# Altium project AM3359.PRJPCB
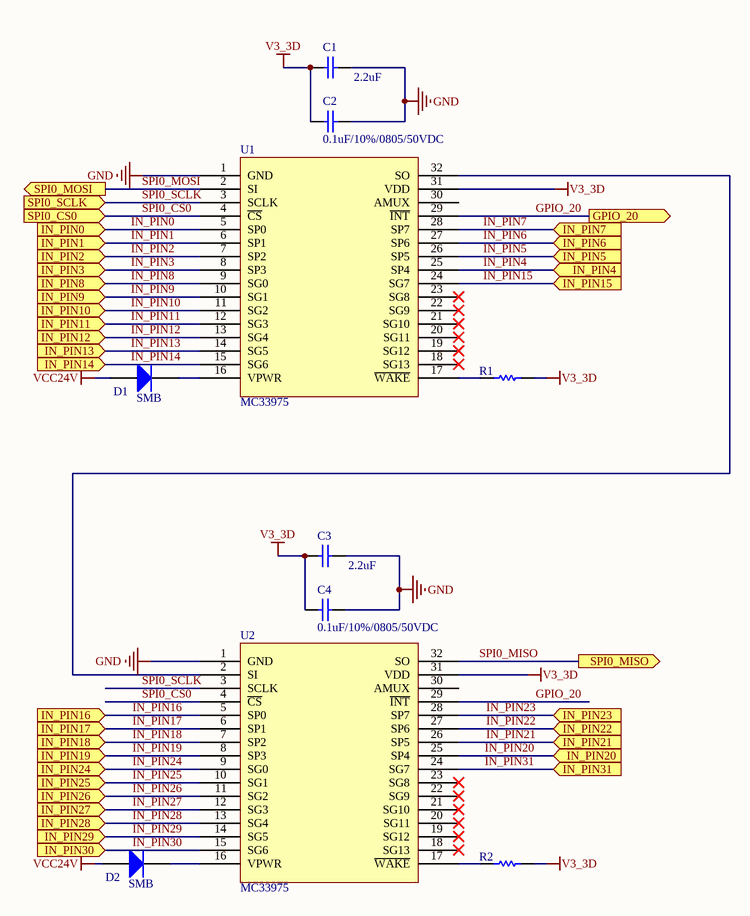
[diagram p0: Sheet2.SchDoc]
4 sheets, 145 parts. Net scope: flat (ports and power ports of the same name join across sheets).
Board file: PCB2.PcbDoc
Sheets:
  Sheet2.SchDoc
  Sheet4.SchDoc
  Sheet5.SchDoc
  Sheet6.SchDoc

## Sheet Sheet2.SchDoc
size B

### Parts
C1  value 2.2uF  [C-0805]  (hidden comment: Cap)
C2  0.1uF/10%/0805/50VDC  [C-0805]
C3  value 2.2uF  [C-0805]  (hidden comment: Cap)
C4  0.1uF/10%/0805/50VDC  [C-0805]
D1  SMB  [SMB]
D2  SMB  [SMB]
R1  10K/1%/0805/1/8W  [R-0805]  (value not drawn)
R2  10K/1%/0805/1/8W  [R-0805]  (value not drawn)
U1  MC33975  [SOIC-32]
U2  MC33975  [SOIC-32]

### Ports
GPIO_20 (out), IN_PIN0 (in), IN_PIN1 (in), IN_PIN2 (in), IN_PIN3 (in), IN_PIN4 (in), IN_PIN5 (in), IN_PIN6 (in), IN_PIN7 (in), IN_PIN8 (in), IN_PIN9 (in), IN_PIN10 (in), IN_PIN11 (in), IN_PIN12 (in), IN_PIN13 (in), IN_PIN14 (in), IN_PIN15 (in), IN_PIN16 (in), IN_PIN17 (in), IN_PIN18 (in), IN_PIN19 (in), IN_PIN20 (in), IN_PIN21 (in), IN_PIN22 (in), IN_PIN23 (in), IN_PIN24 (in), IN_PIN25 (in), IN_PIN26 (in), IN_PIN27 (in), IN_PIN28 (in), IN_PIN29 (in), IN_PIN30 (in), IN_PIN31 (in), SPI0_CS0 (in), SPI0_MISO (out), SPI0_MOSI (out), SPI0_SCLK (in)

### Nets
GND: C1.1 C2.1 C3.1 C4.1 U1.1(GND) U2.1(GND)
V3_3D: C1.2 C2.2 C3.2 C4.2 R1.1 R2.1 U1.31(VDD) U2.31(VDD)
VCC24V: D1.1(A) D2.1(A)
GPIO_20: U1.29(~{INT}) U2.29(~{INT}) ; port GPIO_20
IN_PIN0: U1.5(SP0) ; port IN_PIN0
IN_PIN1: U1.6(SP1) ; port IN_PIN1
IN_PIN2: U1.7(SP2) ; port IN_PIN2
IN_PIN3: U1.8(SP3) ; port IN_PIN3
IN_PIN4: U1.25(SP4) ; port IN_PIN4
IN_PIN5: U1.26(SP5) ; port IN_PIN5
IN_PIN6: U1.27(SP6) ; port IN_PIN6
IN_PIN7: U1.28(SP7) ; port IN_PIN7
IN_PIN8: U1.9(SG0) ; port IN_PIN8
IN_PIN9: U1.10(SG1) ; port IN_PIN9
IN_PIN10: U1.11(SG2) ; port IN_PIN10
IN_PIN11: U1.12(SG3) ; port IN_PIN11
IN_PIN12: U1.13(SG4) ; port IN_PIN12
IN_PIN13: U1.14(SG5) ; port IN_PIN13
IN_PIN14: U1.15(SG6) ; port IN_PIN14
IN_PIN15: U1.24(SG7) ; port IN_PIN15
IN_PIN16: U2.5(SP0) ; port IN_PIN16
IN_PIN17: U2.6(SP1) ; port IN_PIN17
IN_PIN18: U2.7(SP2) ; port IN_PIN18
IN_PIN19: U2.8(SP3) ; port IN_PIN19
IN_PIN20: U2.25(SP4) ; port IN_PIN20
IN_PIN21: U2.26(SP5) ; port IN_PIN21
IN_PIN22: U2.27(SP6) ; port IN_PIN22
IN_PIN23: U2.28(SP7) ; port IN_PIN23
IN_PIN24: U2.9(SG0) ; port IN_PIN24
IN_PIN25: U2.10(SG1) ; port IN_PIN25
IN_PIN26: U2.11(SG2) ; port IN_PIN26
IN_PIN27: U2.12(SG3) ; port IN_PIN27
IN_PIN28: U2.13(SG4) ; port IN_PIN28
IN_PIN29: U2.14(SG5) ; port IN_PIN29
IN_PIN30: U2.15(SG6) ; port IN_PIN30
IN_PIN31: U2.24(SG7) ; port IN_PIN31
SPI0_CS0: U1.4(~{CS}) U2.4(~{CS}) ; port SPI0_CS0
SPI0_MISO: U2.32(SO) ; port SPI0_MISO
SPI0_MOSI: U1.2(SI) ; port SPI0_MOSI
SPI0_SCLK: U1.3(SCLK) U2.3(SCLK) ; port SPI0_SCLK
NetD1_2: D1.2(K) U1.16(VPWR)
NetD2_2: D2.2(K) U2.16(VPWR)
NetR1_2: R1.2 U1.17(~{WAKE})
NetR2_2: R2.2 U2.17(~{WAKE})
NetU1_32: U1.32(SO) U2.2(SI)

Not connected (* = marked no-connect by the designer): U1 18(SG13)* 19(SG12)* 20(SG11)* 21(SG10)* 22(SG9)* 23(SG8)* 30(AMUX); U2 18(SG13)* 19(SG12)* 20(SG11)* 21(SG10)* 22(SG9)* 23(SG8)* 30(AMUX)

### Library data of the parts
C1 C3 = Cap: Capacitor; Published: 8-Jun-2000; LatestRevisionDate: 17-Jul-2002; LatestRevisionNote: Re-released for DXP Platform.; PackageReference: RAD-0.3; Publisher: Altium Limited
C2 C4 = ASC-0024CA: 名称: 贴片电容; 型号: CGA4J2X8R1H104K125AA; 品牌: TDK; 规格: 0.1uF/10%/0805/50VDC
D1 D2 = Diode 1N5408: 3 Amp Medium Power Silicon Rectifier Diode; Published: 8-Jun-2000; LatestRevisionDate: 17-Jul-2002; LatestRevisionNote: Re-released for DXP Platform.; DatasheetVersion: Aug-1984; PackageReference: DO-201AD; Publisher: Altium Limited; PackageDescription: Diode, Axial; Body 9.5 x 5.3 mm (LxDia. max), Lead Dia. 1.32 mm (max); ComponentLink1Description: Manufacturer Link; ComponentLink1URL: http://www.irf.com/
R1 R2 = ASR-0030AA: Part Number: ASR-0028BA; 名称: 贴片电阻; 型号: RC0805FR-0710KL; 品牌: YAGEO; 规格: 10K/1%/0805/1/8W

## Sheet Sheet4.SchDoc
size B
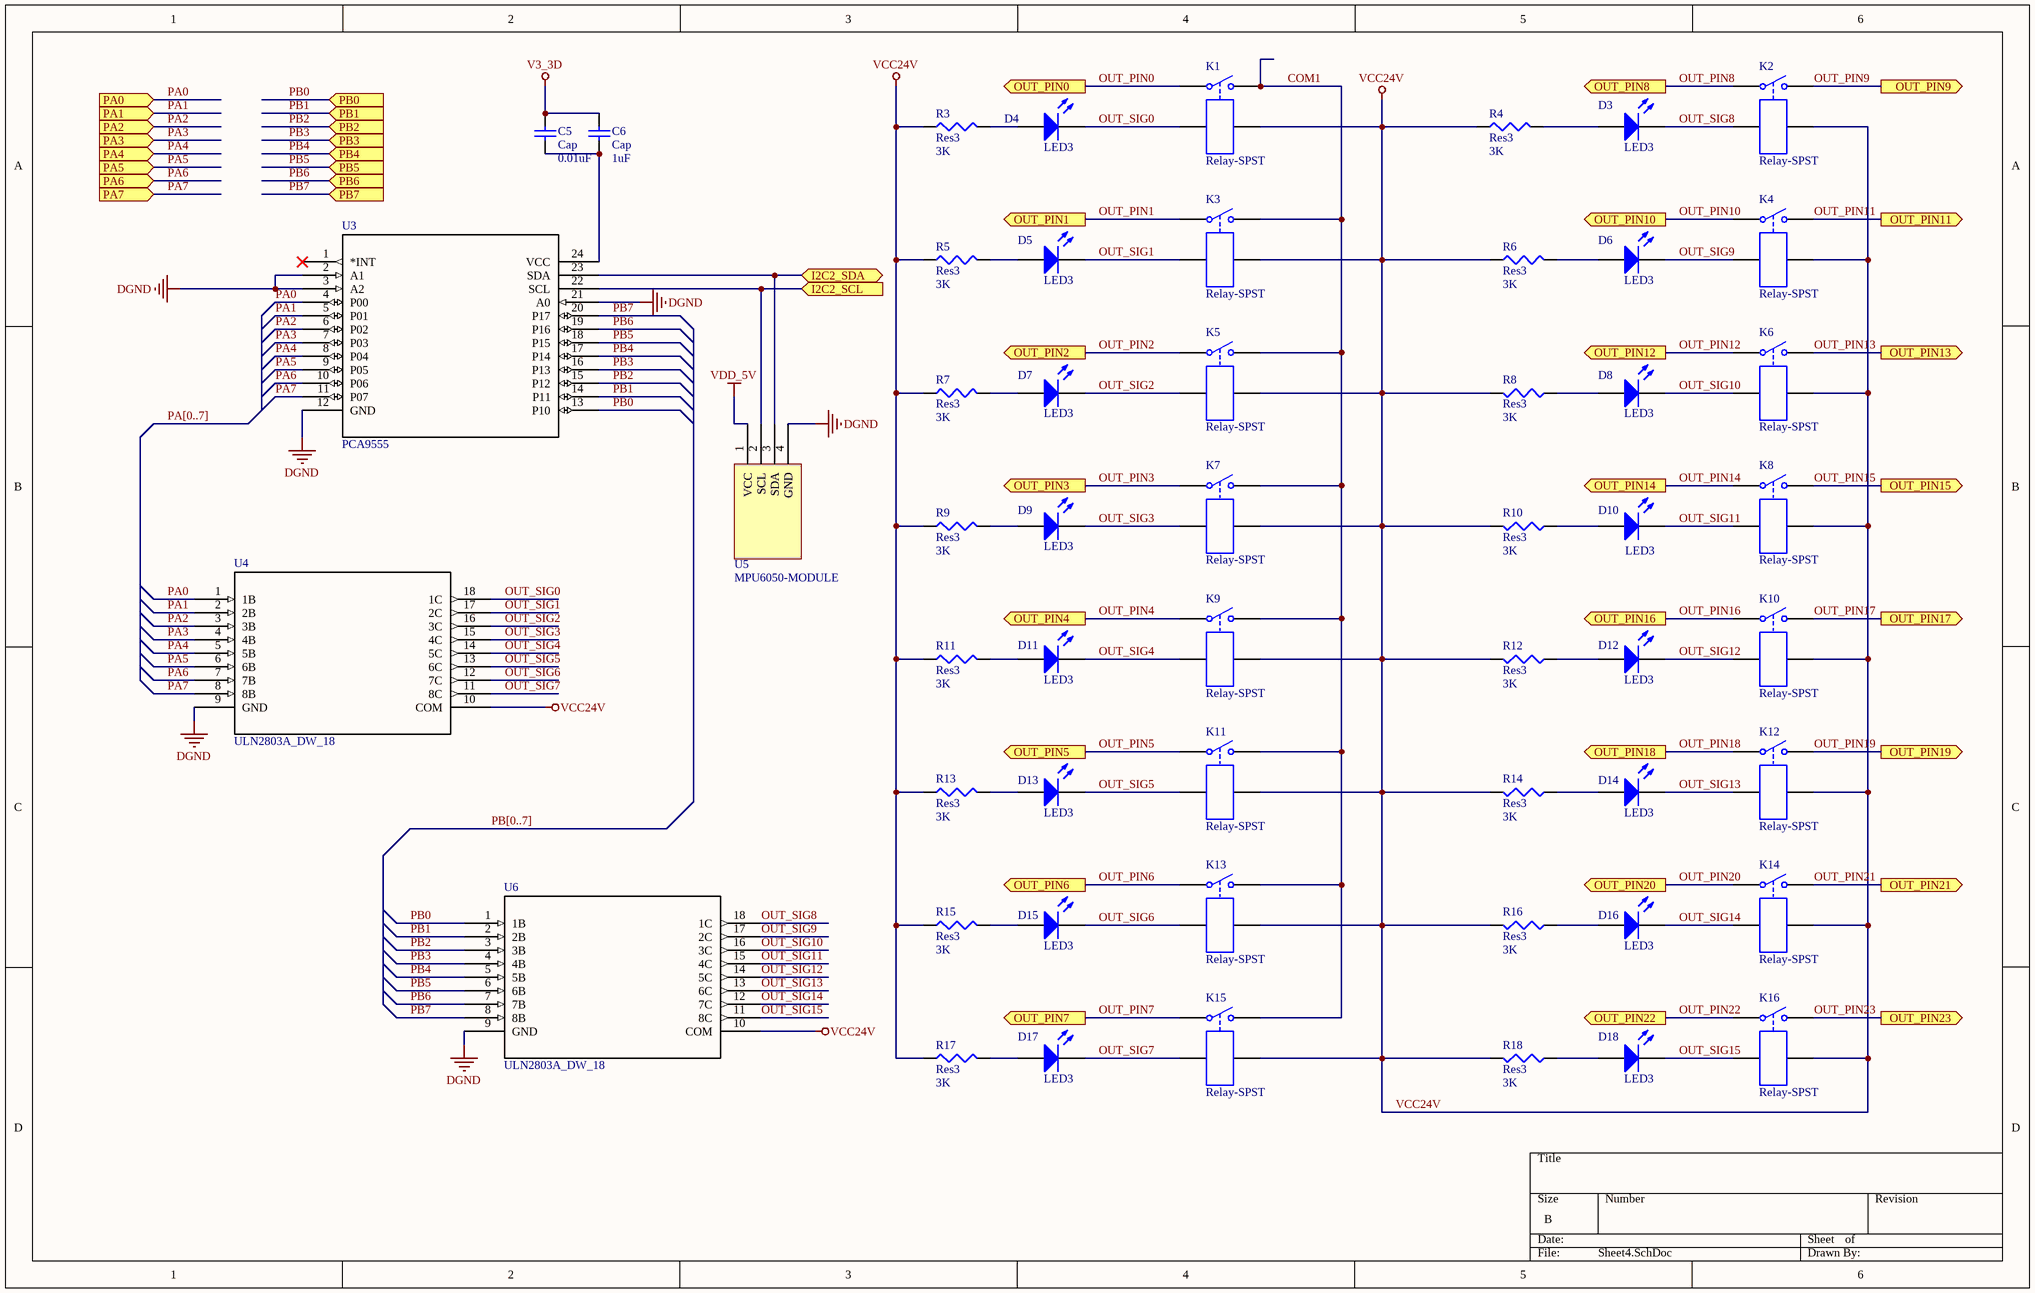
[diagram p1: Sheet4.SchDoc]

### Parts
C5  Cap  value 0.01uF  [0805_cap]
C6  Cap  value 1uF  [0805_cap]
D3  LED3  [0805LED]
D4  LED3  [0805LED]
D5  LED3  [0805LED]
D6  LED3  [0805LED]
D7  LED3  [0805LED]
D8  LED3  [0805LED]
D9  LED3  [0805LED]
D10  LED3  [0805LED]
D11  LED3  [0805LED]
D12  LED3  [0805LED]
D13  LED3  [0805LED]
D14  LED3  [0805LED]
D15  LED3  [0805LED]
D16  LED3  [0805LED]
D17  LED3  [0805LED]
D18  LED3  [0805LED]
K1  Relay-SPST  [PA1a-24v]
K2  Relay-SPST  [PA1a-24v]
K3  Relay-SPST  [PA1a-24v]
K4  Relay-SPST  [PA1a-24v]
K5  Relay-SPST  [PA1a-24v]
K6  Relay-SPST  [PA1a-24v]
K7  Relay-SPST  [PA1a-24v]
K8  Relay-SPST  [PA1a-24v]
K9  Relay-SPST  [PA1a-24v]
K10  Relay-SPST  [PA1a-24v]
K11  Relay-SPST  [PA1a-24v]
K12  Relay-SPST  [PA1a-24v]
K13  Relay-SPST  [PA1a-24v]
K14  Relay-SPST  [PA1a-24v]
K15  Relay-SPST  [PA1a-24v]
K16  Relay-SPST  [PA1a-24v]
R3  Res3  value 3K  [0805]
R4  Res3  value 3K  [0805]
R5  Res3  value 3K  [0805]
R6  Res3  value 3K  [0805]
R7  Res3  value 3K  [0805]
R8  Res3  value 3K  [0805]
R9  Res3  value 3K  [0805]
R10  Res3  value 3K  [0805]
R11  Res3  value 3K  [0805]
R12  Res3  value 3K  [0805]
R13  Res3  value 3K  [0805]
R14  Res3  value 3K  [0805]
R15  Res3  value 3K  [0805]
R16  Res3  value 3K  [0805]
R17  Res3  value 3K  [0805]
R18  Res3  value 3K  [0805]
U3  PCA9555  [PW24]
U4  ULN2803A_DW_18  [DW18]
U5  MPU6050-MODULE  [MPU6050-MODULE]
U6  ULN2803A_DW_18  [DW18]

### Ports
I2C2_SCL (in), I2C2_SDA (bidir), OUT_PIN0 (out), OUT_PIN1 (out), OUT_PIN2 (out), OUT_PIN3 (out), OUT_PIN4 (out), OUT_PIN5 (out), OUT_PIN6 (out), OUT_PIN7 (out), OUT_PIN8 (out), OUT_PIN9 (out), OUT_PIN10 (out), OUT_PIN11 (out), OUT_PIN12 (out), OUT_PIN13 (out), OUT_PIN14 (out), OUT_PIN15 (out), OUT_PIN16 (out), OUT_PIN17 (out), OUT_PIN18 (out), OUT_PIN19 (out), OUT_PIN20 (out), OUT_PIN21 (out), OUT_PIN22 (out), OUT_PIN23 (out), PA0 (in), PA1 (in), PA2 (in), PA3 (in), PA4 (in), PA5 (in), PA6 (in), PA7 (in), PB0 (in), PB1 (in), PB2 (in), PB3 (in), PB4 (in), PB5 (in), PB6 (in), PB7 (in)

### Nets
DGND: U3.2(A1) U3.3(A2) U3.12(GND) U3.21(A0) U4.9(GND) U5.4(GND) U6.9(GND)
V3_3D: C5.2 C6.2
VCC24V: K1.4 K2.4 K3.4 K4.4 K5.4 K6.4 K7.4 K8.4 K9.4 K10.4 K11.4 K12.4 K13.4 K14.4 K15.4 K16.4 R3.1 R4.1 R5.1 R6.1 R7.1 R8.2 R9.1 R10.2 R11.1 R12.2 R13.1 R14.2 R15.1 R16.2 R17.1 R18.2 U4.10(COM) U6.10(COM)
VDD_5V: U5.1(VCC)
COM1: K1.2 K3.2 K5.2 K7.2 K9.2 K11.2 K13.2 K15.2
OUT_PIN0: K1.1 ; port OUT_PIN0
OUT_PIN1: K3.1 ; port OUT_PIN1
OUT_PIN2: K5.1 ; port OUT_PIN2
OUT_PIN3: K7.1 ; port OUT_PIN3
OUT_PIN4: K9.1 ; port OUT_PIN4
OUT_PIN5: K11.1 ; port OUT_PIN5
OUT_PIN6: K13.1 ; port OUT_PIN6
OUT_PIN7: K15.1 ; port OUT_PIN7
OUT_PIN8: K2.1 ; port OUT_PIN8
OUT_PIN9: K2.2 ; port OUT_PIN9
OUT_PIN10: K4.1 ; port OUT_PIN10
OUT_PIN11: K4.2 ; port OUT_PIN11
OUT_PIN12: K6.1 ; port OUT_PIN12
OUT_PIN13: K6.2 ; port OUT_PIN13
OUT_PIN14: K8.1 ; port OUT_PIN14
OUT_PIN15: K8.2 ; port OUT_PIN15
OUT_PIN16: K10.1 ; port OUT_PIN16
OUT_PIN17: K10.2 ; port OUT_PIN17
OUT_PIN18: K12.1 ; port OUT_PIN18
OUT_PIN19: K12.2 ; port OUT_PIN19
OUT_PIN20: K14.1 ; port OUT_PIN20
OUT_PIN21: K14.2 ; port OUT_PIN21
OUT_PIN22: K16.1 ; port OUT_PIN22
OUT_PIN23: K16.2 ; port OUT_PIN23
OUT_SIG0: D4.2(K) K1.3 U4.18(1C)
OUT_SIG1: D5.2(K) K3.3 U4.17(2C)
OUT_SIG2: D7.2(K) K5.3 U4.16(3C)
OUT_SIG3: D9.2(K) K7.3 U4.15(4C)
OUT_SIG4: D11.2(K) K9.3 U4.14(5C)
OUT_SIG5: D13.2(K) K11.3 U4.13(6C)
OUT_SIG6: D15.2(K) K13.3 U4.12(7C)
OUT_SIG7: D17.2(K) K15.3 U4.11(8C)
OUT_SIG8: D3.2(K) K2.3 U6.18(1C)
OUT_SIG9: D6.2(K) K4.3 U6.17(2C)
OUT_SIG10: D8.2(K) K6.3 U6.16(3C)
OUT_SIG11: D10.2(K) K8.3 U6.15(4C)
OUT_SIG12: D12.2(K) K10.3 U6.14(5C)
OUT_SIG13: D14.2(K) K12.3 U6.13(6C)
OUT_SIG14: D16.2(K) K14.3 U6.12(7C)
OUT_SIG15: D18.2(K) K16.3 U6.11(8C)
PA0: U3.4(P00) U4.1(1B) ; port PA0
PA1: U3.5(P01) U4.2(2B) ; port PA1
PA2: U3.6(P02) U4.3(3B) ; port PA2
PA3: U3.7(P03) U4.4(4B) ; port PA3
PA4: U3.8(P04) U4.5(5B) ; port PA4
PA5: U3.9(P05) U4.6(6B) ; port PA5
PA6: U3.10(P06) U4.7(7B) ; port PA6
PA7: U3.11(P07) U4.8(8B) ; port PA7
PB0: U3.13(P10) U6.1(1B) ; port PB0
PB1: U3.14(P11) U6.2(2B) ; port PB1
PB2: U3.15(P12) U6.3(3B) ; port PB2
PB3: U3.16(P13) U6.4(4B) ; port PB3
PB4: U3.17(P14) U6.5(5B) ; port PB4
PB5: U3.18(P15) U6.6(6B) ; port PB5
PB6: U3.19(P16) U6.7(7B) ; port PB6
PB7: U3.20(P17) U6.8(8B) ; port PB7
NetC5_1: C5.1 C6.1 U3.24(VCC)
NetD3_1: D3.1(A) R4.2
NetD4_1: D4.1(A) R3.2
NetD5_1: D5.1(A) R5.2
NetD6_1: D6.1(A) R6.2
NetD7_1: D7.1(A) R7.2
NetD8_1: D8.1(A) R8.1
NetD9_1: D9.1(A) R9.2
NetD10_1: D10.1(A) R10.1
NetD11_1: D11.1(A) R11.2
NetD12_1: D12.1(A) R12.1
NetD13_1: D13.1(A) R13.2
NetD14_1: D14.1(A) R14.1
NetD15_1: D15.1(A) R15.2
NetD16_1: D16.1(A) R16.1
NetD17_1: D17.1(A) R17.2
NetD18_1: D18.1(A) R18.1
NetU3_22: U3.22(SCL) U5.2(SCL) ; port I2C2_SCL
NetU3_23: U3.23(SDA) U5.3(SDA) ; port I2C2_SDA

Not connected (* = marked no-connect by the designer): U3 1(*INT)*

### Buses and harness runs
bus PA[0..7]
bus PB[0..7]

### Library data of the parts
C5 C6 = Cap: Capacitor; Published: 8-Jun-2000; LatestRevisionDate: 17-Jul-2002; LatestRevisionNote: Re-released for DXP Platform.; PackageReference: RAD-0.3; Publisher: Altium Limited; PackageDescription: Radial Cap, Thru-Hole; 2 Leads; 0.3 in Pin Spacing
D3-D18 = LED3: Typical BLUE SiC LED; Published: 8-Jun-2000; LatestRevisionDate: 17-Dec-2003; LatestRevisionNote: PCB Footprint replaced.; DatasheetVersion: 16-Apr-2002; PackageVersion: 16-Apr-2002; PackageReference: 3.5X2.8X1.9; Publisher: Altium Limited; PackageDescription: SM LED; 2 C-Bend Leads; Body 3.5 x 2.8 x 1.9 mm, inc leads (LxWxH typ)
K1-K16 = Relay-SPST: Single-Pole Single-Throw Relay; Published: 24-Mar-1999; LatestRevisionDate: 17-Jul-2002; LatestRevisionNote: Re-released for DXP Platform.; PackageReference: MODULE4; Publisher: Altium Limited
R3-R18 = Res3: Resistor; Published: 8-Jun-2000; LatestRevisionDate: 29-May-2009; LatestRevisionNote: IPC-7351 Footprint Added.; PackageReference: J1-0603; Publisher: Altium Limited; PackageDescription: Chip Resistor
U3 = PCF8575_PW_24: Imported; Manufacturer: Texas Instruments; INDUSTRY_STD_PKG_TYPE: TSSOP; FAMILY_NAME: I2C IO EXPANDER; PIN_COUNT: 24; PACKAGE_DESIGNATOR: PW; Datasheet URL: http://www.ti.com/lit/gpn/PCF8575; GENERIC_PART_NUMBER: PCF8575; Vendor: Texas Instruments; Manufacturer_Part_Number: pcf8575_pw_24; RefDes: RefDes; Type: DEV; Value: Value
U4 U6 = ULN2803A_DW_18: Imported; Manufacturer: Texas Instruments; INDUSTRY_STD_PKG_TYPE: SOIC; FAMILY_NAME: PERIPHERAL DRIVER AND ACTUATOR; PIN_COUNT: 18; PACKAGE_DESIGNATOR: DW; Datasheet URL: http://www.ti.com/lit/gpn/ULN2803A; GENERIC_PART_NUMBER: ULN2803A; RefDes: RefDes; Type: DEV; Value: Value

## Sheet Sheet5.SchDoc
size B
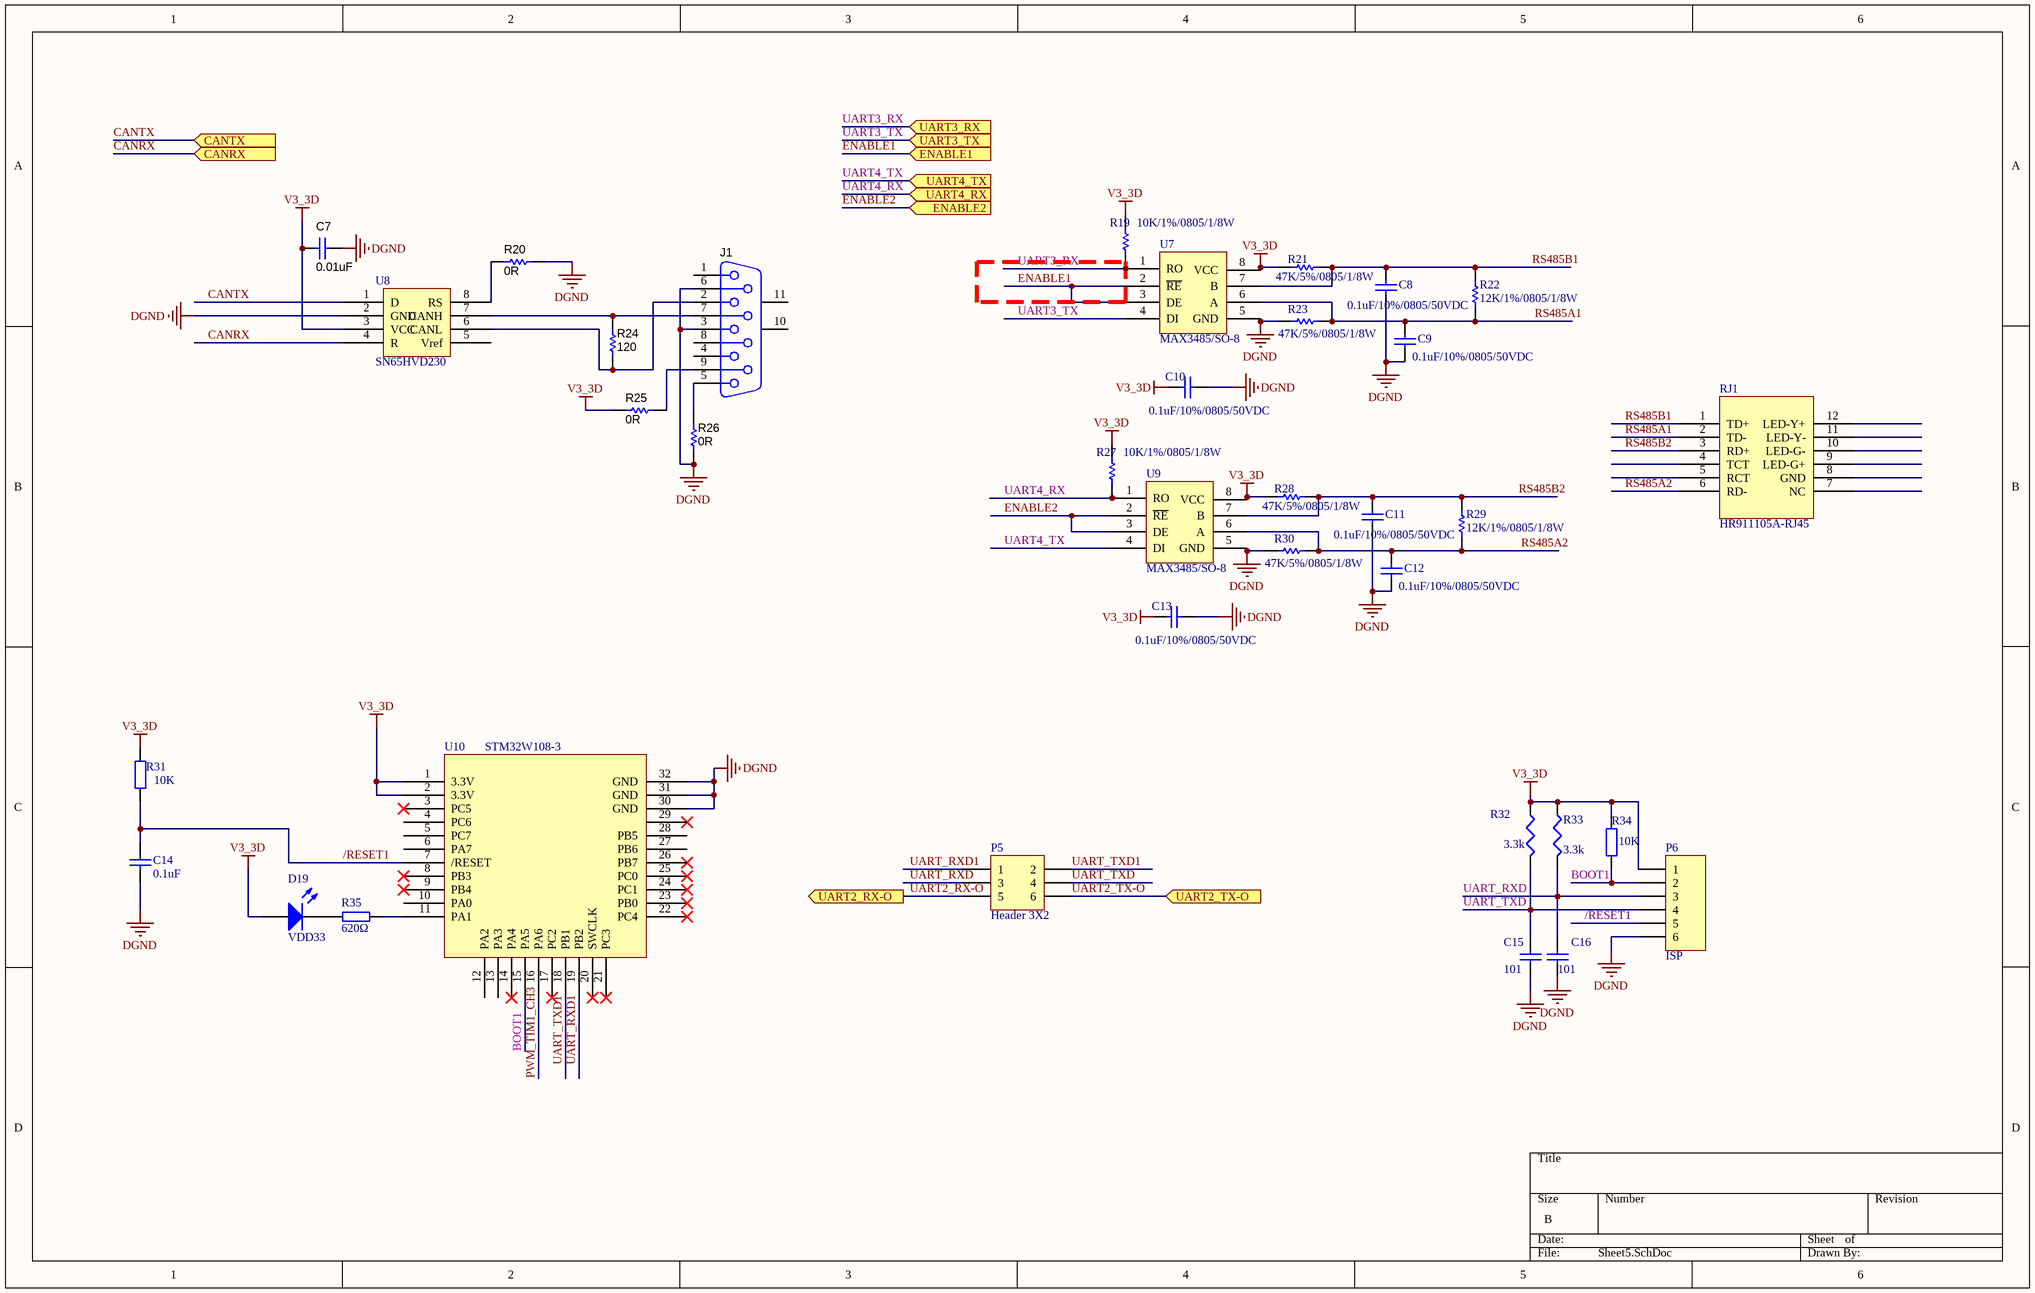
[diagram p2: Sheet5.SchDoc]

### Parts
C7  ValueDisplayed: 0.01uF  [0805_cap]
C8  0.1uF/10%/0805/50VDC  [C-0805]
C9  0.1uF/10%/0805/50VDC  [C-0805]
C10  0.1uF/10%/0805/50VDC  [C-0805]
C11  0.1uF/10%/0805/50VDC  [C-0805]
C12  0.1uF/10%/0805/50VDC  [C-0805]
C13  0.1uF/10%/0805/50VDC  [C-0805]
C14  0.1uF  [C0805]
C15  101  [C0805]
C16  101  [C0805]
D19  VDD33  [0805LED]
J1  (no value)  [CONN_1734348-1]
P5  Header 3X2  [HDR2X3]
P6  ISP  [SIP-6B]
R19  10K/1%/0805/1/8W  [R-0805]
R20  value 0R  [0805_HV]  (hidden comment: CRCW080560R4FKEA)
R21  47K/5%/0805/1/8W  [R-0805]
R22  12K/1%/0805/1/8W  [R-0805]
R23  47K/5%/0805/1/8W  [R-0805]
R24  value 120  [0805_HV]  (hidden comment: CRCW080560R4FKEA)
R25  value 0R  [0805_HV]  (hidden comment: CRCW080560R4FKEA)
R26  value 0R  [0805_HV]  (hidden comment: CRCW080560R4FKEA)
R27  10K/1%/0805/1/8W  [R-0805]
R28  47K/5%/0805/1/8W  [R-0805]
R29  12K/1%/0805/1/8W  [R-0805]
R30  47K/5%/0805/1/8W  [R-0805]
R31  value 10K  [0805]  (hidden comment: Res2)
R32  3.3k  [R0805]
R33  3.3k  [R0805]
R34  value 10K  [R0805]  (hidden comment: Res2)
R35  620Ω  [R0805]
RJ1  HR911105A-RJ45  [HR911105A]
U7  MAX3485/SO-8  [SO-G8]
U8  SN65HVD230  [SO-G8]
U9  MAX3485/SO-8  [SO-G8]
U10  STM32W108-3  [STM32W108-3]

### Ports
CANRX (in), CANTX (in), ENABLE1 (in), ENABLE2 (in), UART2_RX-O (out), UART2_TX-O (in), UART3_RX (in), UART3_TX (in), UART4_RX (in), UART4_TX (in)

### Nets
DGND: C7.2 C8.1 C9.1 C10.2 C11.1 C12.1 C13.2 C14.1 C15.1 C16.1 J1.3 J1.6 P6.6 R20.2 R23.2 R26.1 R30.2 U7.5(GND) U8.2(GND) U9.5(GND) U10.30(GND) U10.31(GND) U10.32(GND)
V3_3D: C7.1 C10.1 C13.1 D19.1(A) P6.1 R19.2 R21.2 R25.2 R27.2 R28.2 R31.2 R32.1 R33.1 R34.2 U7.8(VCC) U8.3(VCC) U9.8(VCC) U10.1(3.3V) U10.2(3.3V)
/RESET1: C14.2 P6.5 R31.1 U10.7(/RESET)
BOOT1: P6.2 R34.1 U10.15(PA5)
CANRX: U8.4(R) ; port CANRX
CANTX: U8.1(D) ; port CANTX
ENABLE1: U7.2(~{RE}) U7.3(DE) ; port ENABLE1
ENABLE2: U9.2(~{RE}) U9.3(DE) ; port ENABLE2
PWM_TIM1_CH3: U10.16(PA6)
RS485A1: C9.2 R22.1 R23.1 RJ1.2(TD-) U7.6(A)
RS485A2: C12.2 R29.1 R30.1 RJ1.6(RD-) U9.6(A)
RS485B1: C8.2 R21.1 R22.2 RJ1.1(TD+) U7.7(B)
RS485B2: C11.2 R28.1 R29.2 RJ1.3(RD+) U9.7(B)
UART2_RX-O: P5.5 ; port UART2_RX-O
UART2_TX-O: P5.6 ; port UART2_TX-O
UART3_RX: R19.1 U7.1(RO) ; port UART3_RX
UART3_TX: U7.4(DI) ; port UART3_TX
UART4_RX: R27.1 U9.1(RO) ; port UART4_RX
UART4_TX: U9.4(DI) ; port UART4_TX
UART_RXD: C16.2 P5.3 P6.3 R33.2
UART_RXD1: P5.1 U10.19(PB2)
UART_TXD: C15.2 P5.4 P6.4 R32.2
UART_TXD1: P5.2 U10.18(PB1)
NetD19_2: D19.2(K) R35.2
NetJ1_2: J1.2 R24.2 U8.6(CANL)
NetJ1_5: J1.5 R26.2
NetJ1_7: J1.7 R24.1 U8.7(CANH)
NetJ1_9: J1.9 R25.1
NetR20_1: R20.1 U8.8(RS)
NetR35_1: R35.1 U10.11(PA1)

Not connected (* = marked no-connect by the designer): J1 1 4 8 10(MH1) 11(MH2); RJ1 4(TCT) 5(RCT) 7(NC) 8(GND) 9(LED-G+) 10(LED-G-) 11(LED-Y-) 12(LED-Y+); U8 5(Vref); U10 3(PC5)* 4(PC6) 5(PC7) 6(PA7) 8(PB3)* 9(PB4)* 10(PA0) 12(PA2) 13(PA3) 14(PA4)* 17(PC2)* 20(SWCLK)* 21(PC3)* 22(PC4)* 23(PB0)* 24(PC1)* 25(PC0)* 26(PB7)* 27(PB6) 28(PB5) 29*

### Library data of the parts
C7 = C1005X7R1C103K: CAP, CERM, 0.01uF, 16V, +/-10%, X7R, 0402; Manufacturer: TDK; Polarized: N; CompType: Capacitor; U/M: EA; Cap_F: 0.00000001; Tolerance_%: 10; ESR_Ohm: 0.0623; Value1: 0.0623 ohm; VDC_V: 16; TaMin_C: -55; TaMax_C: 125; Cap_Case: 0402; SymbolVersion: 2008-07-09; Value: 0.01uF; PartNumber: C1005X7R1C103K; PackageReference: 0402; RoHS: Y; Value2: 16V; MountType: SMT; Technology: Ceramic; Published: 2008-06-19; Publisher: Texas Instruments; LatestRevisionDate: 2013-04-19; LatestRevisionNote: Changed publisher; ComponentLink1Description: Datasheet link; ComponentLink1URL: http://www.tdk.co.jp/tefe02/e412_c.pdf; Supplier 1: Digi-Key; Supplier Part Number 1: 445-1262-1-ND; Supplier 2: Farnell; Supplier Part Number 2: 1844125
C8-C13 = ASC-0024CA: as C2 on sheet Sheet2; 规格: 0.1uF/10%/0805/50VDC
C14-C16 = Cap: Capacitor; Value: 100pF; Published: 8-Jun-2000; LatestRevisionDate: 17-Jul-2002; LatestRevisionNote: Re-released for DXP Platform.; Publisher: Altium Limited
D19 = LED3: Typical BLUE SiC LED; Published: 8-Jun-2000; LatestRevisionDate: 17-Dec-2003; LatestRevisionNote: PCB Footprint replaced.; Publisher: Altium Limited
J1 = 1734348-1: Conn D-SUB RCPT R/A 9POS GOLD/FL, TH; Manufacturer: TE Connectivity; SymbolCreator: a0412235; CompType: Connector; U/M: EA; SymbolVersion: 2012-11-29; PartNumber: 1734348-1; RoHS: Y; PackageReference: D-SUB 9 PIN; MountType: TH; ComponentLink1Description: Datasheet Link; ComponentLink1URL: http://www.te.com/commerce/DocumentDelivery/DDEController?Action=showdoc&DocId=Customer+Drawing%7F1734348%7FB1%7Fpdf%7FEnglish%7FENG_CD_1734348_B1.pdf%7F1734348-1; Publisher: Texas Instruments; LatestRevisionDate: 2013-04-26; Supplier 1: Digi-Key; Supplier Part Number 1: A35109-ND; Supplier 2: Mouser; Supplier Part Number 2: 571-1734348-1; Supplier 3: Farnell; Supplier Part Number 3: 2133699
P5 = Header 3X2: Header, 3-Pin, Dual row; LatestRevisionDate: 17-Jul-2002; LatestRevisionNote: Re-released for DXP Platform.; Publisher: Altium Limited
P6 = Header 6: Header, 6-Pin; LatestRevisionDate: 17-Jul-2002; LatestRevisionNote: Re-released for DXP Platform.; Publisher: Altium Limited
R19 R27 = ASR-0030AA: as R1 on sheet Sheet2; 规格: 10K/1%/0805/1/8W
R20 R25 R26 = CRCW080560R4FKEA: RES, 0 ohm, 1%, 0.125W, 0805; Manufacturer: Vishay-Dale; CompType: Resistor; Res_ohm: 60.4; Value_Code: 60R4; Tolerance_%: 1; Power_W: 0.125; VDC_V: 150; TempCo: 100 ppm/C; EIA_Code: E96; U/M: EA; SymbolVersion: 2009-05-29; PartNumber: CRCW080560R4FKEA; PackageReference: 0805; RoHS: Y; Value1: 1%; Value2: 0.125W; MountType: SMT; Technology: Thick Film; Published: 2008-06-26; Publisher: Texas Instruments; LatestRevisionDate: 2013-04-18; ComponentLink1Description: Datasheet link; ComponentLink1URL: http://www.vishay.com/docs/20035/dcrcwe3.pdf; Supplier 1: Digi-Key; Supplier Part Number 1: 541-60.4CCT-ND; Supplier 2: Mouser; Supplier Part Number 2: 71-CRCW0805-60.4-E3; Supplier 3: Farnell; Supplier Part Number 3: 1469951
R21 R23 R28 R30 = ASR-0134BA: 名称: 贴片电阻; 型号: RC0805JR-0747KL; 品牌: YAGEO; Part Number: ASR-0134BA; 规格: 47K/5%/0805/1/8W
R22 R29 = ASR-0028BA: 名称: 贴片电阻; 品牌: YAGEO; 规格: 12K/1%/0805/1/8W
R24 = CRCW080560R4FKEA: RES, 120ohm, 1%, 0.125W, 0805; Manufacturer: Vishay-Dale; CompType: Resistor; Res_ohm: 60.4; Value_Code: 60R4; Tolerance_%: 1; Power_W: 0.125; VDC_V: 150; TempCo: 100 ppm/C; EIA_Code: E96; U/M: EA; SymbolVersion: 2009-05-29; PartNumber: CRCW080560R4FKEA; PackageReference: 0805; RoHS: Y; Value1: 1%; Value2: 0.125W; MountType: SMT; Technology: Thick Film; Published: 2008-06-26; Publisher: Texas Instruments; LatestRevisionDate: 2013-04-18; ComponentLink1Description: Datasheet link; ComponentLink1URL: http://www.vishay.com/docs/20035/dcrcwe3.pdf; Supplier 1: Digi-Key; Supplier Part Number 1: 541-60.4CCT-ND; Supplier 2: Mouser; Supplier Part Number 2: 71-CRCW0805-60.4-E3; Supplier 3: Farnell; Supplier Part Number 3: 1469951
R31 R34 = Res2: Resistor; Published: 8-Jun-2000; LatestRevisionDate: 17-Jul-2002; LatestRevisionNote: Re-released for DXP Platform.; PackageReference: AXIAL-0.4; Publisher: Altium Limited
R32 R33 = Res3: Resistor; Value: 1K; Published: 8-Jun-2000; LatestRevisionDate: 17-Jul-2002; LatestRevisionNote: Re-released for DXP Platform.; Publisher: Altium Limited
R35 = RES: R
U7 U9 = MAX485: 名称: 485通讯; 规格: SO-8; 型号: MAX3485; 品牌: *; Part Number: *

## Sheet Sheet6.SchDoc
size B
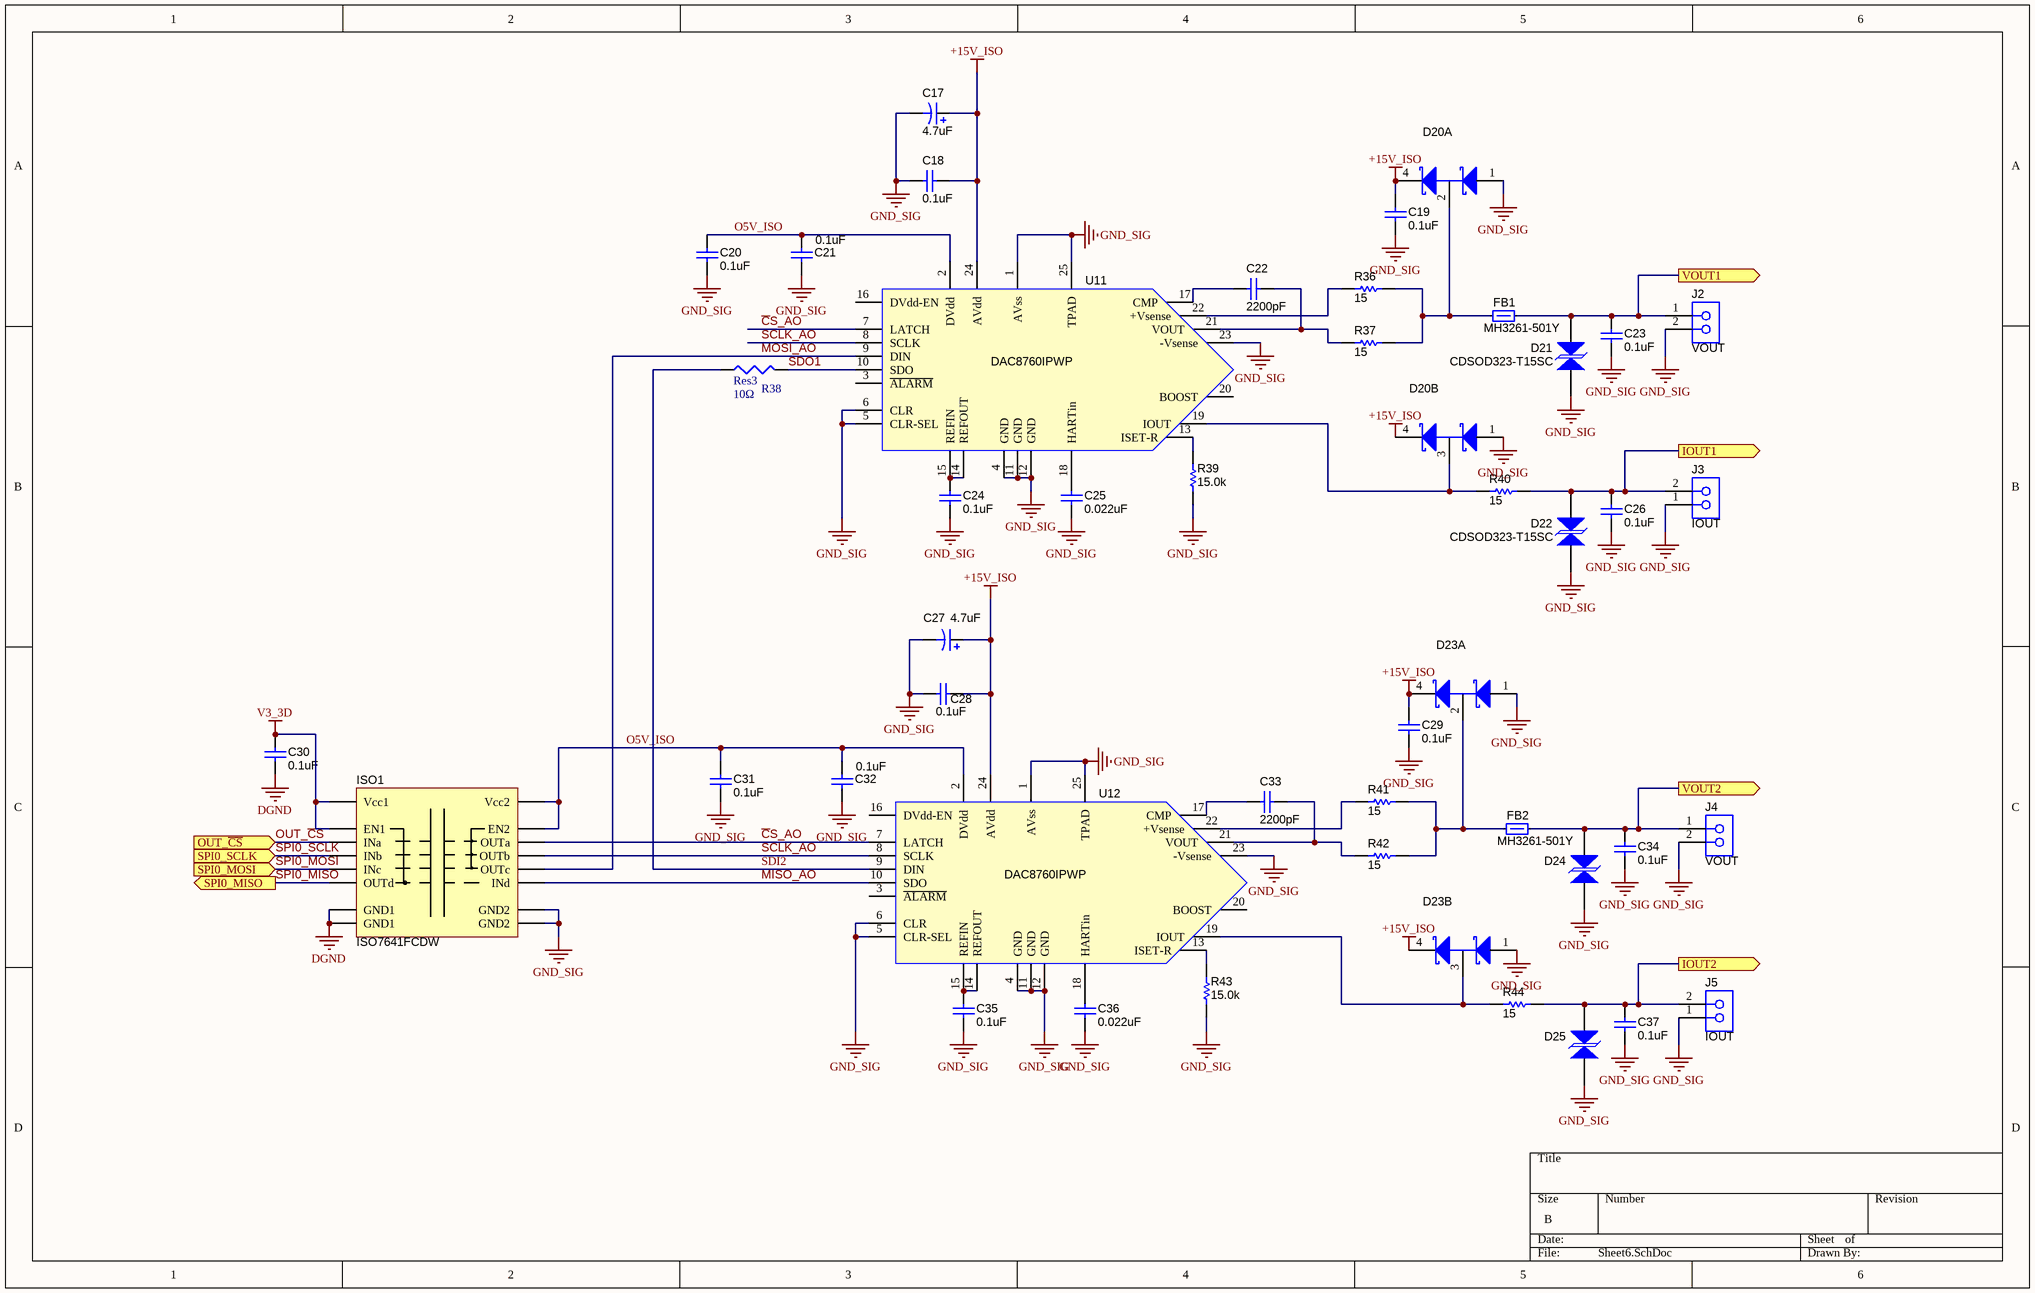
[diagram p3: Sheet6.SchDoc]

### Parts
C17  ValueDisplayed: 4.7uF  [6032-28]  (hidden comment: 293D475X9035C2TE3)
C18  ValueDisplayed: 0.1uF  [0805_cap]  (hidden comment: GRM188R71H104KA93D)
C19  ValueDisplayed: 0.1uF  [0805_cap]  (hidden comment: GRM188R71H104KA93D)
C20  ValueDisplayed: 0.1uF  [0805_cap]  (hidden comment: GRM188R71H104KA93D)
C21  ValueDisplayed: 0.1uF  [0805_cap]  (hidden comment: GRM188R71H104KA93D)
C22  ValueDisplayed: 2200pF  [0805_cap]  (hidden comment: GRM1885C1H222JA01D)
C23  ValueDisplayed: 0.1uF  [0805_cap]  (hidden comment: 06035C104KAT2A)
C24  ValueDisplayed: 0.1uF  [0805_cap]  (hidden comment: 06035C104KAT2A)
C25  ValueDisplayed: 0.022uF  [0805_cap]  (hidden comment: C1608X7R1H223K)
C26  ValueDisplayed: 0.1uF  [0805_cap]  (hidden comment: 06035C104KAT2A)
C27  ValueDisplayed: 4.7uF  [6032-28]  (hidden comment: 293D475X9035C2TE3)
C28  ValueDisplayed: 0.1uF  [0805_cap]  (hidden comment: GRM188R71H104KA93D)
C29  ValueDisplayed: 0.1uF  [0805_cap]  (hidden comment: GRM188R71H104KA93D)
C30  ValueDisplayed: 0.1uF  [0805_cap]  (hidden comment: GRM188R71H104KA93D)
C31  ValueDisplayed: 0.1uF  [0805_cap]  (hidden comment: GRM188R71H104KA93D)
C32  ValueDisplayed: 0.1uF  [0805_cap]  (hidden comment: GRM188R71H104KA93D)
C33  ValueDisplayed: 2200pF  [0805_cap]  (hidden comment: GRM1885C1H222JA01D)
C34  ValueDisplayed: 0.1uF  [0805_cap]  (hidden comment: 06035C104KAT2A)
C35  ValueDisplayed: 0.1uF  [0805_cap]  (hidden comment: 06035C104KAT2A)
C36  ValueDisplayed: 0.022uF  [0805_cap]  (hidden comment: C1608X7R1H223K)
C37  ValueDisplayed: 0.1uF  [0805_cap]  (hidden comment: 06035C104KAT2A)
D20  (no value)  [SOT-143]  (parts A,B of 2)
D21  CDSOD323-T15SC  [sod-323]
D22  CDSOD323-T15SC  [sod-323]
D23  (no value)  [SOT-143]  (parts A,B of 2)
D24  (no value)  [sod-323]
D25  (no value)  [sod-323]
FB1  MH3261-501Y  [1210]
FB2  MH3261-501Y  [1210]
ISO1  ISO7641FCDW  [M16B_N]
J2  VOUT  [ED555/2DS]
J3  IOUT  [ED555/2DS]
J4  VOUT  [ED555/2DS]
J5  IOUT  [ED555/2DS]
R36  value 15  [0805]  (hidden comment: CRCW060315R0JNEA)
R37  value 15  [0805]  (hidden comment: CRCW060315R0JNEA)
R38  Res3  value 10Ω  [0805]
R39  value 15.0k  [0805]  (hidden comment: RT0603BRD0715KL)
R40  value 15  [1210]  (hidden comment: RPC2512JT15R0)
R41  value 15  [0805]  (hidden comment: CRCW060315R0JNEA)
R42  value 15  [0805]  (hidden comment: CRCW060315R0JNEA)
R43  value 15.0k  [0805]  (hidden comment: RT0603BRD0715KL)
R44  value 15  [1210]  (hidden comment: RPC2512JT15R0)
U11  DAC8760IPWP  [PWP24-DIE84X166]
U12  DAC8760IPWP  [PWP24-DIE84X166]

### Ports
IOUT1 (out), IOUT2 (out), OUT_~{CS} (in), SPI0_MISO (out), SPI0_MOSI (in), SPI0_SCLK (in), VOUT1 (out), VOUT2 (out)

### Nets
+15V_ISO: C17.1(+) C18.1 C19.1 C27.1(+) C28.1 C29.1 D20.4 D23.4 U11.24(AVdd) U12.24(AVdd)
DGND: C30.2 ISO1.2(GND1) ISO1.8(GND1)
GND_SIG: C17.2(-) C18.2 C19.2 C20.2 C21.2 C23.2 C24.2 C25.2 C26.2 C27.2(-) C28.2 C29.2 C31.2 C32.2 C34.2 C35.2 C36.2 C37.2 D20.1 D21.2 D22.2 D23.1 D24.2 D25.2 ISO1.9(GND2) ISO1.15(GND2) J2.2 J3.1 J4.2 J5.1 R39.1 R43.1 U11.1(AVss) U11.4(GND) U11.5(CLR-SEL) U11.6(CLR) U11.11(GND) U11.12(GND) U11.23(-Vsense) U11.25(TPAD) U12.1(AVss) U12.4(GND) U12.5(CLR-SEL) U12.6(CLR) U12.11(GND) U12.12(GND) U12.23(-Vsense) U12.25(TPAD)
V3_3D: C30.1 ISO1.1(Vcc1) ISO1.7(EN1)
~{C}S_AO: ISO1.14(OUTa) U11.7(LATCH) U12.7(LATCH)
MISO_AO: ISO1.11(INd) U12.10(SDO)
MOSI_AO: ISO1.12(OUTc) U11.9(DIN)
O5V_ISO: C20.1 C21.1 C31.1 C32.1 ISO1.10(EN2) ISO1.16(Vcc2) U11.2(DVdd) U12.2(DVdd)
OUT_~{CS}: ISO1.3(INa) ; port OUT_~{CS}
SCLK_AO: ISO1.13(OUTb) U11.8(SCLK) U12.8(SCLK)
SDI2: R38.1 U12.9(DIN)
SDO1: R38.2 U11.10(SDO)
SPI0_MISO: ISO1.6(OUTd) ; port SPI0_MISO
SPI0_MOSI: ISO1.5(INc) ; port SPI0_MOSI
SPI0_SCLK: ISO1.4(INb) ; port SPI0_SCLK
NetC22_1: C22.1 R37.1 U11.21(VOUT)
NetC22_2: C22.2 U11.17(CMP)
NetC23_1: C23.1 D21.1 FB1.2 J2.1 ; port VOUT1
NetC24_1: C24.1 U11.14(REFOUT) U11.15(REFIN)
NetC25_1: C25.1 U11.18(HARTin)
NetC26_1: C26.1 D22.1 J3.2 R40.2 ; port IOUT1
NetC33_1: C33.1 R42.1 U12.21(VOUT)
NetC33_2: C33.2 U12.17(CMP)
NetC34_1: C34.1 D24.1 FB2.2 J4.1 ; port VOUT2
NetC35_1: C35.1 U12.14(REFOUT) U12.15(REFIN)
NetC36_1: C36.1 U12.18(HARTin)
NetC37_1: C37.1 D25.1 J5.2 R44.2 ; port IOUT2
NetD20_2: D20.2 FB1.1 R36.2 R37.2
NetD20_3: D20.3 R40.1 U11.19(IOUT)
NetD23_2: D23.2 FB2.1 R41.2 R42.2
NetD23_3: D23.3 R44.1 U12.19(IOUT)
NetR36_1: R36.1 U11.22(+Vsense)
NetR39_2: R39.2 U11.13(ISET-R)
NetR41_1: R41.1 U12.22(+Vsense)
NetR43_2: R43.2 U12.13(ISET-R)

Not connected (* = marked no-connect by the designer): U11 3(~{ALARM}) 16(DVdd-EN) 20(BOOST); U12 3(~{ALARM}) 16(DVdd-EN) 20(BOOST)

### Library data of the parts
C17 C27 = 293D475X9035C2TE3: CAP, TA, 4.7uF, 35V, +/-10%, 1.9 ohm, SMD; Manufacturer: Vishay-Sprague; Polarized: Y; CompType: Capacitor; U/M: EA; Cap_F: 0.0000047; Tolerance_%: 10; Value1: 1.9 ohm; VDC_V: 35; ESR_Ohm: 1.9; IRMS_A: 0.24; TaMin_C: -55; TaMax_C: 125; Cap_Case: C; SymbolVersion: 2008-07-09; Value: 4.7uF; PartNumber: 293D475X9035C2TE3; PackageReference: 6032-28; RoHS: Y; Value2: 35V; MountType: SMT; Technology: TA; Series: 293D; Publisher: Texas Instruments; LatestRevisionDate: 2013-11-07; LatestRevisionNote: Updated supplier links; ComponentLink1Description: Datasheet link; ComponentLink1URL: http://www.vishay.com/docs/40002/293d.pdf; Supplier 1: Digi-Key; Supplier Part Number 1: 718-1083-1-ND; Supplier 2: Mouser; Supplier Part Number 2: 74-293D475X9035C2TE3; Supplier 3: Farnell; Supplier Part Number 3: 1612257
C18-C21 C28-C32 = GRM188R71H104KA93D: CAP, CERM, 0.1uF, 50V, +/-10%, X7R, 0603; Manufacturer: MuRata; Polarized: N; CompType: Capacitor; U/M: EA; Cap_F: 0.0000001; Tolerance_%: 10; VDC_V: 50; TaMin_C: -55; TaMax_C: 125; Cap_Case: 0603; SymbolVersion: 2008-07-09; Value: 0.1uF; PartNumber: GRM188R71H104KA93D; PackageReference: 0603; RoHS: Y; Value1: ?; Value2: 50V; MountType: SMT; Technology: Ceramic; TempCo: X7R; Published: 2008-06-19; Publisher: Texas Instruments; LatestRevisionDate: 2012-04-11; LatestRevisionNote: Changed publisher; ComponentLink1Description: Datasheet link; ComponentLink1URL: http://search.murata.co.jp/Ceramy/PnsearchViewAction.do?HnOFG=ON&HnNFG=ON&SEL_CNT=50&sLang=en&sKey=GRM188R71H104KA93D&x=9&y=9&search=startwith; Alternate PartNumber: -; Alternate Manufacturer: -; Supplier 1: Digi-Key; Supplier Part Number 1: 490-1519-1-ND; Supplier 2: Farnell; Supplier Part Number 2: 1118182; Supplier 3: Arrow; Supplier Part Number 3: GRM188R71H104KA93D
C22 C33 = GRM1885C1H222JA01D: CAP, CERM, 2200pF, 50V, +/-5%, C0G/NP0, 0603; Manufacturer: MuRata; Polarized: N; CompType: Capacitor; U/M: EA; Cap_F: 0.0000000022; Tolerance_%: 5; Value1: Unknown; VDC_V: 50; TaMin_C: -55; TaMax_C: 125; Cap_Case: 0603; SymbolVersion: 2008-07-09; Value: 2200pF; PartNumber: GRM1885C1H222JA01D; PackageReference: 0603; RoHS: Y; Value2: 50V; MountType: SMT; Technology: Ceramic; TempCo: C0G/NP0; Published: 2008-06-19; Publisher: Texas Instruments; LatestRevisionDate: 2013-05-24; LatestRevisionNote: Changed publisher; ComponentLink1Description: Datasheet link; ComponentLink1URL: http://search.murata.co.jp/Ceramy/PnsearchViewAction.do?HnOFG=ON&HnNFG=ON&SEL_CNT=50&sLang=en&sKey=GRM1885C1H222JA01D&x=9&y=9&search=startwith; Supplier 1: Digi-Key; Supplier Part Number 1: 490-1459-1-ND; Supplier 2: Mouser; Supplier Part Number 2: 81-GRM1885C1H222JA01; Supplier 3: Farnell; Supplier Part Number 3: 8819947
C23 C24 C26 C34 C35 C37 = 06035C104KAT2A: CAP, CERM, 0.1uF, 50V, +/-10%, X7R, 0603; Manufacturer: AVX; Polarized: N; CompType: Capacitor; U/M: EA; Cap_F: 0.0000001; Tolerance_%: 10; Value1: Unknown; VDC_V: 50; TaMin_C: -55; TaMax_C: 125; Cap_Case: 0603; SymbolVersion: 2008-07-09; Value: 0.1uF; PartNumber: 06035C104KAT2A; PackageReference: 0603; RoHS: Y; Value2: 50V; MountType: SMT; Technology: Ceramic; TempCo: X7R; Published: 2008-06-19; Publisher: Texas Instruments; LatestRevisionDate: 2013-05-24; LatestRevisionNote: Changed publisher; ComponentLink1Description: Datasheet link; ComponentLink1URL: http://www.avx.com/docs/Catalogs/cx7r.pdf; Supplier 1: Digi-Key; Supplier Part Number 1: 478-5052-1-ND; Supplier 2: Mouser; Supplier Part Number 2: 581-06035C104KAT2A; Supplier 3: Farnell; Supplier Part Number 3: 1301804
C25 C36 = C1608X7R1H223K: CAP, CERM, 0.022uF, 50V, +/-10%, X7R, 0603; Manufacturer: TDK; Polarized: N; CompType: Capacitor; U/M: EA; Cap_F: 0.000000022; Tolerance_%: 10; ESR_Ohm: 0.0383; Value1: 0.0383 ohm; VDC_V: 50; TaMin_C: -55; TaMax_C: 125; Cap_Case: 0603; SymbolVersion: 2008-07-09; Value: 0.022uF; PartNumber: C1608X7R1H223K; PackageReference: 0603; RoHS: Y; Value2: 50V; MountType: SMT; Technology: Ceramic; TempCo: X7R; Published: 2008-06-19; Publisher: Texas Instruments; LatestRevisionDate: 2013-05-24; LatestRevisionNote: Changed publisher; ComponentLink1Description: Datasheet link; ComponentLink1URL: http://www.tdk.co.jp/tefe02/e412_c.pdf; Supplier 1: Digi-Key; Supplier Part Number 1: 445-1312-1-ND; Supplier 2: Farnell; Supplier Part Number 2: 1907316
D20 D23 = CD143A-SR70: IC TVS ARRAY 2-LINE 70V SOT-143; Manufacturer: Bourns; SymbolVersion: use current date i.e. 2008-05-20; SymbolCreator: Use LDAP id; U/M: EA, IN, or GM; MountType: SMT; RoHS: y; PartNumber: CD143A-SR70; PackageReference: TO-253-4; ComponentLink1Description: Datasheet Link; ComponentLink1URL: http://www.digikey.com/product-detail/en/CD143A-SR70/CD143A-SR70CT-ND/1630599; CompType: TVS; Alternate PartNumber: -; Alternate Manufacturer: -; Supplier Part Number 1: CD143A-SR70CT-ND
D21 D22 = SMAJ15CA: DIODE TVS ARRAY 15V SOD323; Manufacturer: Bourns; SymbolVersion: use current date i.e. 2008-05-20; SymbolCreator: Use LDAP id; U/M: EA, IN, or GM; MountType: SMT; RoHS: Y; PartNumber: CDSOD323-T15SC; PackageReference: SMA; ComponentLink1Description: Datasheet Link; CompType: TVS; Alternate PartNumber: -; Alternate Manufacturer: -; Supplier Part Number 1: CDSOD323-T15SCCT-ND; Supplier 1: Digi-Key
D24 D25 = SMAJ15CA: DIODE TVS ARRAY 15V SOD323; Manufacturer: Bourns; PartNumber: CDSOD323-T15SC; SymbolVersion: use current date i.e. 2008-05-20; SymbolCreator: Use LDAP id; U/M: EA, IN, or GM; MountType: SMT; RoHS: Y; PackageReference: SMA; ComponentLink1Description: Datasheet Link; CompType: TVS; Alternate PartNumber: -; Alternate Manufacturer: -; Supplier Part Number 1: CDSOD323-T15SCCT-ND; Supplier 1: Digi-Key
FB1 FB2 = Ferrite_Bead: BEAD FERRITE 500 OHM 3.0A 3216; Manufacturer: Bourns Inc.; CompType: Resistor; U/M: EA; SymbolVersion: 2009-06-02; PackageReference: 1812; PartNumber: MH3261-501Y; RoHS: Y; MountType: SMT; Publisher: Texas Instruments; Alternate Manufacturer: -; Alternate PartNumber: -; Supplier1: Digi-Key; Supplier Part Number 1: MH3261-501YCT-ND
ISO1 = ISO7241: ISOLATOR DGTL 25MBPS 4CH 16SOIC; Manufacturer: Texas Instruments Inc; SymbolVersion: use current date i.e. 2008-05-20; SymbolCreator: Use LDAP id; CompType: Used in some BOM reports.  Useful for finding later.; U/M: EA, IN, or GM; MountType: SMT; RoHS: Y; PartNumber: ISO7641FCDW; PackageReference: SOIC-16; ComponentLink1Description: http://www.ti.com/lit/ds/symlink/iso7241c.pdf; Alternate PartNumber: -; Alternate Manufacturer: -; Supplier Part Number 1: ISO7641FCDW-ND
J2-J5 = 1727010: TERMINAL BLOCK 3.5MM 2POS PCB; Manufacturer: On Shore Technology Inc; U/M: EA; Value: 2x1; SymbolVersion: 2010-10-20; PartNumber: ED555/2DS; CompType: Terminal Block; RoHS: Y; MountType: TH; ComponentLink1Description: Datasheet Link; Publisher: Texas Instruments; LatestRevisionDate: 2012-05-17; LatestRevisionNote: Changed publisher; Alternate Manufacturer: -; Alternate PartNumber: -; Supplier 1: Digi-Key; Supplier Part Number 1: ED1514-ND
  J2 J4: ComponentLink1URL: http://eshop.phoenixcontact.com/phoenix/pdf.do?UID=1727010&general=usen
R36 R37 R41 R42 = CRCW060315R0JNEA: RES, 15 ohm, 5%, 0.1W, 0603; Manufacturer: Vishay-Dale; CompType: Resistor; Value_Code: 15R0; Tolerance_%: 5; Power_W: 0.1; VDC_V: 75; TempCo: 200 ppm/C; EIA_Code: E24; U/M: EA; SymbolVersion: 2009-05-29; PartNumber: CRCW060315R0JNEA; PackageReference: 0603; RoHS: Y; Res_ohm: 15; Value1: 5%; Value2: 0.1W; MountType: SMT; Technology: Thick Film; Published: 2008-06-26; Publisher: Texas Instruments; LatestRevisionDate: 2013-01-08; ComponentLink1Description: Datasheet link; ComponentLink1URL: http://www.vishay.com/docs/20035/dcrcwe3.pdf; Supplier 1: Digi-Key; Supplier Part Number 1: 541-15GCT-ND; Supplier 2: Mouser; Supplier Part Number 2: 71-CRCW0603J-15-E3; Supplier 3: Farnell; Supplier Part Number 3: 1514720
R38 = Res3: Resistor; Published: 8-Jun-2000; LatestRevisionDate: 29-May-2009; LatestRevisionNote: IPC-7351 Footprint Added.; PackageReference: J1-0603; Publisher: Altium Limited; PackageDescription: Chip Resistor
R39 R43 = RT0603BRD0715KL: RES, 15.0k ohm, 0.1%, 0.1W, 0603; Manufacturer: Yageo America; CompType: Resistor; Res_ohm: 15000; Value_Code: 15k0; Tolerance_%: 0.1; VDC_V: 75; TempCo: 25 ppm/C; EIA_Code: E192; U/M: EA; SymbolVersion: 2009-05-29; PartNumber: RT0603BRD0715KL; PackageReference: 0603; RoHS: Y; Value1: 0.1%; Power_W: 0.1; Value2: 0.1W; MountType: SMT; Technology: Thin Film; Published: 2008-06-26; Publisher: Texas Instruments; LatestRevisionDate: 2012-04-20; LatestRevisionNote: Changed publisher; ComponentLink1Description: Datasheet link; ComponentLink1URL: http://www.yageo.com/pdf/PYu-RT_1-to-0.05_RoHS_L_3.pdf; Alternate PartNumber: -; Alternate Manufacturer: -; Supplier Part Number 1: RT0603BRD0715KL-ND
R40 R44 = CRA2512-FZ-R080ELF: RES 15 OHM 1W 5% 2512; Manufacturer: Stackpole Electronics; CompType: Resistor; Value_Code: 15R; Tolerance_%: 5; Power_W: 3; VDC_V: 0; U/M: EA; SymbolVersion: 2009-05-29; PartNumber: RPC2512JT15R0; PackageReference: 2512; RoHS: Y; Res_ohm: 15; Value1: 5%; Value2: 1W; MountType: SMT; Technology: Metal Film; LatestRevisionDate: 2012-04-20; LatestRevisionNote: Changed publisher; ComponentLink1Description: Datasheet link; Alternate PartNumber: -; Alternate Manufacturer: -; Supplier 1: Digi-Key; Supplier Part Number 1: RPC2512JT15R0CT-ND
U11 U12 = DAC8760IPWP_1: 1-Channel, 16-Bit, Programmable Current/Voltage Output DAC for 4-20mA Current Loop Applications; Manufacturer: Texas Instruments; CompType: IC; SymbolCreator: x0120606; ComponentLink1URL: http://www.ti.com/lit/gpn/dac8760; PartNumber: DAC8760IPWP; Alternate Manufacturer: *; Alternate PartNumber: *; PackageReference: HTSSOP (PWP) 24; MountType: SMT; Publisher: Texas Instruments; RoHS: Y; ComponentLink1Description: Datasheet link

## Nets that join several sheets
DGND: Sheet4 (7 pins), Sheet5 (23 pins), Sheet6 (C30.2 ISO1.2 ISO1.8)
V3_3D: Sheet2 (8 pins), Sheet4 (C5.2 C6.2), Sheet5 (19 pins), Sheet6 (C30.1 ISO1.1 ISO1.7)
VCC24V: Sheet2 (D1.1 D2.1), Sheet4 (34 pins)
SPI0_MISO: Sheet2 (U2.32), Sheet6 (ISO1.6)
SPI0_MOSI: Sheet2 (U1.2), Sheet6 (ISO1.5)
SPI0_SCLK: Sheet2 (U1.3 U2.3), Sheet6 (ISO1.4)